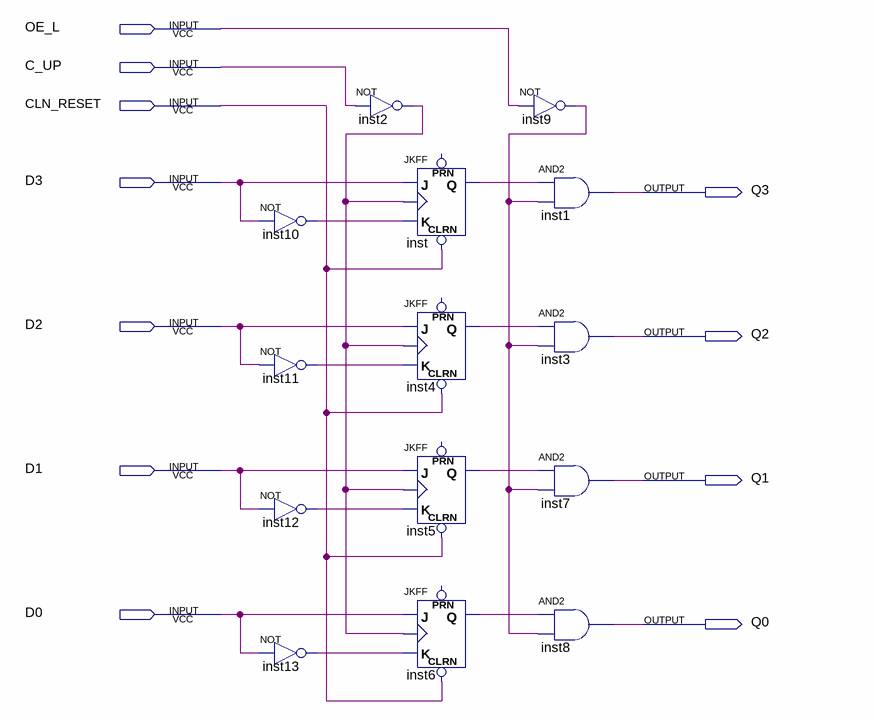
[diagram p0: schematic sheet]
// Quartus schematic Laboratory_work_5_1_project.bdf as structural Verilog: 14 symbols, 11 pins
module Laboratory_work_5_1_project (
  input  OE_L,
  input  C_UP,
  input  CLN_RESET,
  input  D3,
  input  D2,
  input  D1,
  input  D0,
  output Q3,
  output Q2,
  output Q1,
  output Q0
);

  wire inst2_out, inst4_q, inst5_q, inst6_q, inst9_out, inst10_out, inst11_out, inst12_out, inst13_out,
       inst_q;

  not inst10 (inst10_out, D3);
  not inst11 (inst11_out, D2);
  not inst12 (inst12_out, D1);
  not inst13 (inst13_out, D0);
  not inst2 (inst2_out, C_UP);
  JKFF inst (.CLRN(CLN_RESET), .K(inst10_out), .J(D3), .CLK(inst2_out), .Q(inst_q));  // open: PRN
  JKFF inst4 (.CLRN(CLN_RESET), .K(inst11_out), .J(D2), .CLK(inst2_out), .Q(inst4_q));  // open: PRN
  JKFF inst5 (.CLRN(CLN_RESET), .K(inst12_out), .J(D1), .CLK(inst2_out), .Q(inst5_q));  // open: PRN
  JKFF inst6 (.CLRN(CLN_RESET), .K(inst13_out), .J(D0), .CLK(inst2_out), .Q(inst6_q));  // open: PRN
  not inst9 (inst9_out, OE_L);
  and inst1 (Q3, inst_q, inst9_out);
  and inst3 (Q2, inst4_q, inst9_out);
  and inst7 (Q1, inst5_q, inst9_out);
  and inst8 (Q0, inst6_q, inst9_out);
endmodule
